# Altium schematic sheet RlyCtrl.SchDoc
size A4
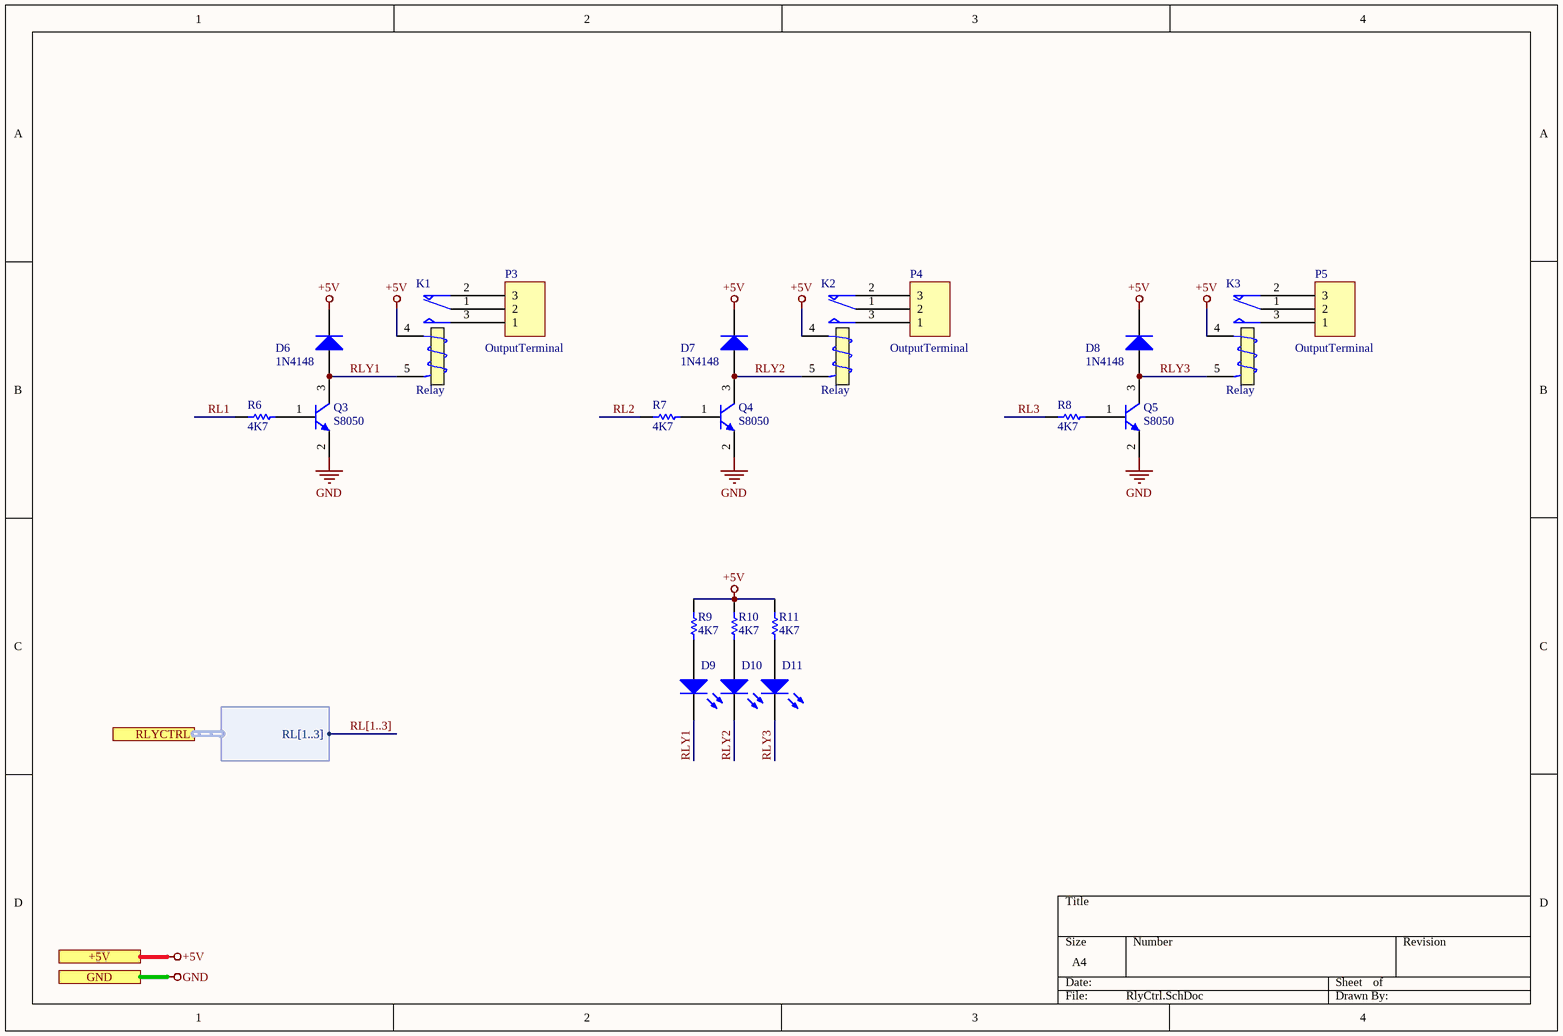
[diagram p0: RlyCtrl.SchDoc]

## Parts
D6  1N4148  [D-SOD-80]
D7  1N4148  [D-SOD-80]
D8  1N4148  [D-SOD-80]
D9  SMD0805-RED  [LED-0805]  (value not drawn)
D10  SMD0805-RED  [LED-0805]  (value not drawn)
D11  SMD0805-RED  [LED-0805]  (value not drawn)
K1  Relay  [MODULE5B]
K2  Relay  [MODULE5B]
K3  Relay  [MODULE5B]
P3  value OutputTerminal  [TER-KF128-3P]  (hidden comment: KF128-3P)
P4  value OutputTerminal  [TER-KF128-3P]  (hidden comment: KF128-3P)
P5  value OutputTerminal  [TER-KF128-3P]  (hidden comment: KF128-3P)
Q3  S8050  [TO-226-AA]
Q4  S8050  [TO-226-AA]
Q5  S8050  [TO-226-AA]
R6  4K7  [AXIAL-0.3]
R7  4K7  [AXIAL-0.3]
R8  4K7  [AXIAL-0.3]
R9  4K7  [R-0805]
R10  4K7  [R-0805]
R11  4K7  [R-0805]

## Ports
+5V, GND, RLYCTRL (harness RLYCTRL)

## Harnesses
RLYCTRL: RL[1..3]

## Nets
+5V: D6.2(K) D7.2(K) D8.2(K) K1.4(T1) K2.4(T1) K3.4(T1) R9.2 R10.2 R11.2 ; port +5V
GND: Q3.2(E) Q4.2(E) Q5.2(E) ; port GND
RL1: R6.2
RL2: R7.2
RL3: R8.2
RLY1: D6.1(A) D9.2(K) K1.5(T2) Q3.3(C)
RLY2: D7.1(A) D10.2(K) K2.5(T2) Q4.3(C)
RLY3: D8.1(A) D11.2(K) K3.5(T2) Q5.3(C)
NetD9_1: D9.1(A) R9.1
NetD10_1: D10.1(A) R10.1
NetD11_1: D11.1(A) R11.1
NetK1_1: K1.1(COM) P3.2
NetK1_2: K1.2(NC) P3.3
NetK1_3: K1.3(NO) P3.1
NetK2_1: K2.1(COM) P4.2
NetK2_2: K2.2(NC) P4.3
NetK2_3: K2.3(NO) P4.1
NetK3_1: K3.1(COM) P5.2
NetK3_2: K3.2(NC) P5.3
NetK3_3: K3.3(NO) P5.1
NetQ3_1: Q3.1(B) R6.1
NetQ4_1: Q4.1(B) R7.1
NetQ5_1: Q5.1(B) R8.1

## Buses and harness runs
bus RL[1..3]

## Library data of the parts
D6-D8 = Diode 1N4004: 1 Amp General Purpose Rectifier; Published: 8-Jun-2000; LatestRevisionDate: 17-Jul-2002; LatestRevisionNote: Re-released for DXP Platform.; DatasheetDocument: 1998; PackageDocument: Aug-1999; PackageReference: DO-41; Value: 1N4148; Code_JEDEC: DO-204-AL; ComponentLink1Description: Manufacturer Link; ComponentLink1URL: http://www.fairchildsemi.com/; ComponentLink2Description: Datasheet; ComponentLink2URL: http://www.fairchildsemi.com/ds/1N%2F1N4001.pdf
D9-D11 = LED0: Typical INFRARED GaAs LED; Value: PowerLed; Published: 8-Jun-2000; LatestRevisionDate: 08-Jul-2005; LatestRevisionNote: Mech Layer 1 removed.; PackageReference: LED-0
K1-K3 = Relay: SPDT Relay; Published: 8-Jun-2000; LatestRevisionDate: 17-Jul-2002; LatestRevisionNote: Re-released for DXP Platform.; PackageReference: MODULE5B; Publisher: Altium Limited
P3-P5 = Header 3: Header, 3-Pin; LatestRevisionDate: 17-Jul-2002; LatestRevisionNote: Re-released for DXP Platform.
Q3-Q5 = NPN: NPN Bipolar Transistor; Manufacturer: MCC; Manufacturer Part Number: MMSS8050-H-TP; Max Power Dissipation: 625mW; hFE Min: 120; Collector Emitter Voltage (VCEO): 500mV; Collector Base Voltage (VCBO): 40V; Emitter Base Voltage (VEBO): 5V; Max Collector Current: 1.5A; Collector Emitter Breakdown Voltage: 25V; Transition Frequency: 100MHz; Element Configuration: Single; ComponentLink1URL: http://www.mouser.com/ds/2/258/MMSS8050-255048.pdf; ComponentLink1Description: http://www.mouser.com/ds/2/258/MMSS8050-255048.pdf; ComponentLink2URL: http://www.mccsemi.com/up_pdf/MMSS8050(SOT-23).pdf; ComponentLink2Description: http://www.mccsemi.com/up_pdf/MMSS8050(SOT-23).pdf; Supplier 1: Digi-Key; Supplier Part Number 1: MMSS8050-H-TPMSCT-ND; Stock 1: 109361; Pricing 1: 1=0.21, 10=0.19, 25=0.1728, 100=0.1246, 250=0.0734, 500=0.0609, 1000=0.0415 (USD); Mount: Surface Mount; Case/Package: SOT-23; Number of Pins: 3; Min Operating Temperature: -55°C; Max Operating Temperature: 150°C; Packaging: Tape and Reel; Package Quantity: 3000; Polarity: NPN; Collector Emitter Saturation Voltage: 500mV; Gain Bandwidth Product: 100MHz; Max Breakdown Voltage: 25V; Lead Free: Lead Free
R6-R11 = Res1: Resistor
  R6-R8: Supplier 1: Digi-Key; Supplier Part Number 1: P4.7KGCT-ND
  R9-R11: Published: 8-Jun-2000; LatestRevisionDate: 17-Jul-2002; LatestRevisionNote: Re-released for DXP Platform.; PackageReference: AXIAL-0.3; Publisher: Altium Limited; PackageDescription: Axial Device, Thru-Hole; 2 Leads; 0.3 in Pin Spacing; Value: 4K7